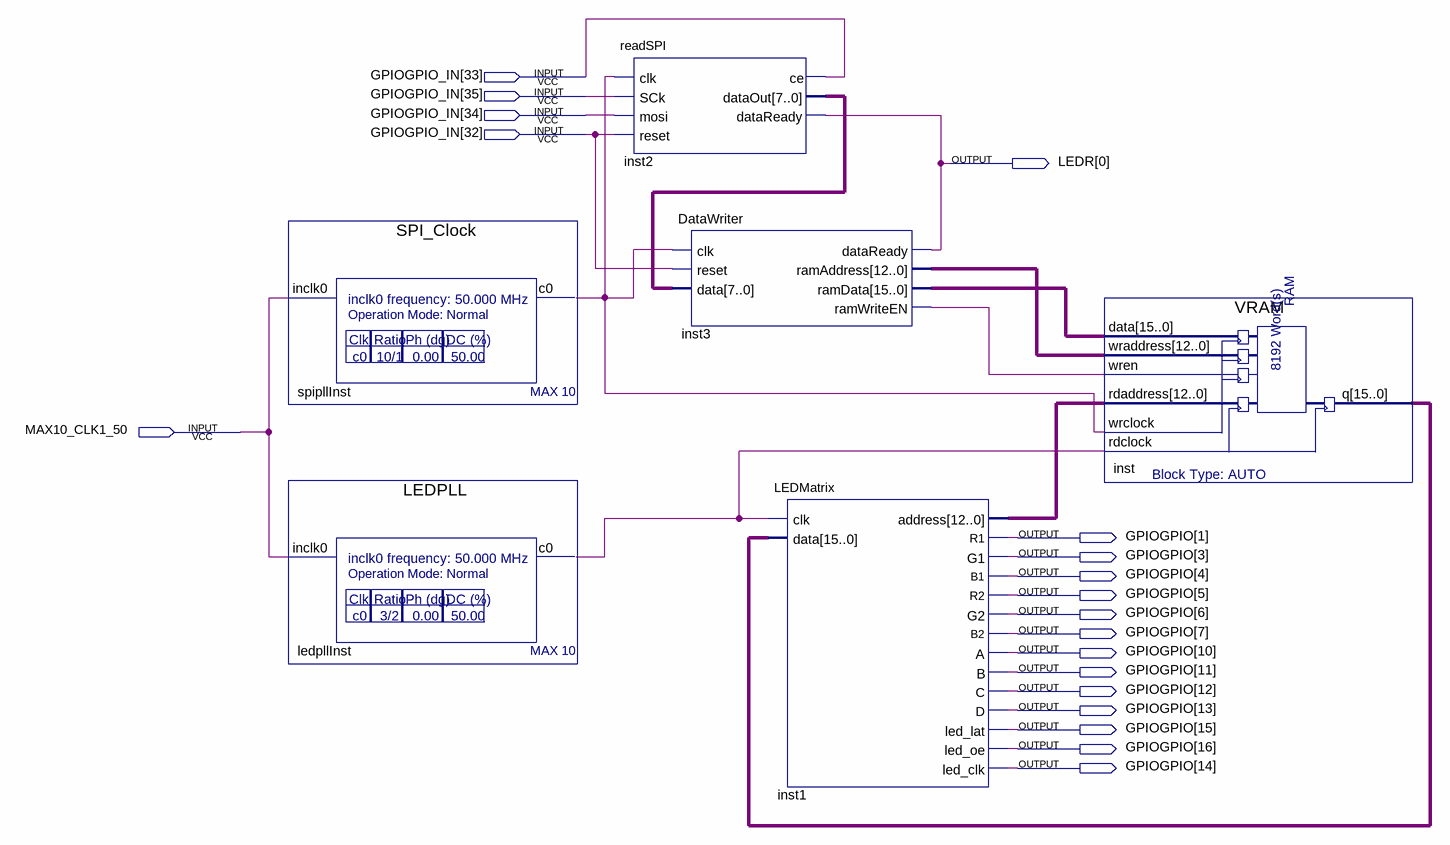
[diagram p0: schematic sheet]
// Quartus schematic Main.bdf as structural Verilog: 6 symbols, 19 pins
module Main (
  input  [35:32] GPIOGPIO_IN,
  input  MAX10_CLK1_50,
  output [0:0] LEDR,
  output [16:1] GPIOGPIO
);

  wire inst3_ramwriteen, ledpllInst_c0, spipllInst_c0;
  wire [7:0] inst2_dataout;
  wire [12:0] inst1_address, inst3_ramaddress;
  wire [15:0] inst3_ramdata, inst_q;

  SPI_Clock spipllInst (.inclk0(MAX10_CLK1_50), .c0(spipllInst_c0));
  LEDPLL ledpllInst (.inclk0(MAX10_CLK1_50), .c0(ledpllInst_c0));
  readSPI inst2 (
    .clk(spipllInst_c0), .SCk(GPIOGPIO_IN[35]), .mosi(GPIOGPIO_IN[34]), .reset(GPIOGPIO_IN[32]),
    .dataOut(inst2_dataout), .dataReady(LEDR[0]), .ce(GPIOGPIO_IN[33]));
  DataWriter inst3 (
    .clk(spipllInst_c0), .reset(GPIOGPIO_IN[32]), .data(inst2_dataout), .ramAddress(inst3_ramaddress),
    .ramData(inst3_ramdata), .ramWriteEN(inst3_ramwriteen), .dataReady(LEDR[0]));
  LEDMatrix inst1 (
    .clk(ledpllInst_c0), .data(inst_q), .address(inst1_address), .R1(GPIOGPIO[1]), .G1(GPIOGPIO[3]),
    .B1(GPIOGPIO[4]), .R2(GPIOGPIO[5]), .G2(GPIOGPIO[6]), .B2(GPIOGPIO[7]), .A(GPIOGPIO[10]),
    .B(GPIOGPIO[11]), .C(GPIOGPIO[12]), .D(GPIOGPIO[13]), .led_lat(GPIOGPIO[15]), .led_oe(GPIOGPIO[16]),
    .led_clk(GPIOGPIO[14]));
  VRAM inst (
    .data(inst3_ramdata), .wraddress(inst3_ramaddress), .wren(inst3_ramwriteen), .rdaddress(inst1_address),
    .wrclock(spipllInst_c0), .rdclock(ledpllInst_c0), .q(inst_q));
endmodule
